# Altium schematic sheet 3V3 Buck Converter.SchDoc: LM27403 3.3V Buck Converter
size Letter; SheetNumber: 4; SheetTotal: 18
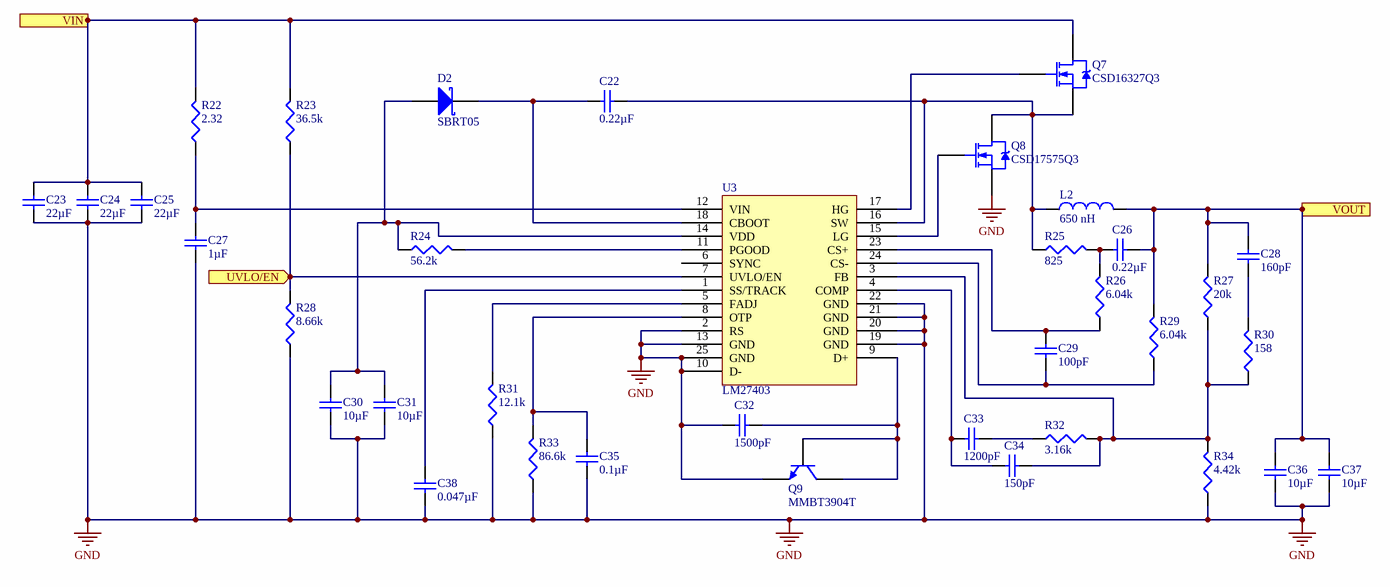
[diagram p0: 3V3 Buck Converter.SchDoc]

## Parts
C22  value 0.22µF  [TY-0402V]  (hidden comment: Cap)
C23  value 22µF  [TY-1210M]  (hidden comment: Cap)
C24  value 22µF  [TY-1210M]  (hidden comment: Cap)
C25  value 22µF  [TY-1210M]  (hidden comment: Cap)
C26  value 0.22µF  [TY-0402V]  (hidden comment: Cap)
C27  value 1µF  [TY-0402V]  (hidden comment: Cap)
C28  value 160pF  [KEM-CBR04]  (hidden comment: Cap)
C29  value 100pF  [TDK-CGA2B]  (hidden comment: Cap)
C30  value 10µF  [TY-0603A]  (hidden comment: Cap)
C31  value 10µF  [TY-0603A]  (hidden comment: Cap)
C32  value 1500pF  [TDK-CGA2B]  (hidden comment: Cap)
C33  value 1200pF  [KEM-0402BB]  (hidden comment: Cap)
C34  value 150pF  [TDK-CGA2B]  (hidden comment: Cap)
C35  value 0.1µF  [TDK-CGA2B]  (hidden comment: Cap)
C36  value 10µF  [TY-1210M]  (hidden comment: Cap)
C37  value 10µF  [TY-1210M]  (hidden comment: Cap)
C38  value 0.047µF  [TDK-CGA2B]  (hidden comment: Cap)
D2  SBRT05  [DIOD-X2-DFN1006-2]
L2  value 650 nH  [CCI-XAL7070]  (hidden comment: XAL7070-651MEC)
Q7  CSD16327Q3  [TI-Q3]
Q8  CSD17575Q3  [TI-Q3]
Q9  MMBT3904T  [SOT523]
R22  value 2.32  [VSH-0402MCS]  (hidden comment: Res3)
R23  value 36.5k  [PANA-ERA2A]  (hidden comment: Res3)
R24  value 56.2k  [PANA-ERA2A]  (hidden comment: Res3)
R25  value 825  [PANA-ERA2A]  (hidden comment: Res3)
R26  value 6.04k  [PANA-ERA2A]  (hidden comment: Res3)
R27  value 20k  [PANA-ERJ2R]  (hidden comment: Res3)
R28  value 8.66k  [PANA-ERA2A]  (hidden comment: Res3)
R29  value 6.04k  [PANA-ERA2A]  (hidden comment: Res3)
R30  value 158  [PANA-ERA2A]  (hidden comment: Res3)
R31  value 12.1k  [PANA-ERA2A]  (hidden comment: Res3)
R32  value 3.16k  [PANA-ERA2A]  (hidden comment: Res3)
R33  value 86.6k  [PANA-ERA2A]  (hidden comment: Res3)
R34  value 4.42k  [PANA-ERA2A]  (hidden comment: Res3)
U3  LM27403  [TI-RTW0024A]

## Ports
UVLO/EN (in), VIN (in), VOUT (out)

## Nets
GND: C23.1 C24.1 C25.1 C27.1 C30.1 C31.1 C32.1 C35.1 C36.1 C37.1 C38.1 Q8.3(S) Q9.1(E) R28.1 R31.1 R33.1 R34.1 U3.2(RS) U3.10(D-) U3.13(GND) U3.19(GND) U3.20(GND) U3.21(GND) U3.22(GND) U3.25(GND)
UVLO/EN: R23.1 R28.2 U3.7(UVLO/EN) ; port UVLO/EN
VIN: C23.2 C24.2 C25.2 Q7.2(D) R22.2 R23.2 ; port VIN
VOUT: C26.2 C28.2 C36.2 C37.2 L2.2 R27.2 R29.2 ; port VOUT
NetC22_1: C22.1 D2.2(K) U3.18(CBOOT)
NetC22_2: C22.2 L2.1 Q7.3(S) Q8.2(D) R25.1 U3.16(SW)
NetC26_1: C26.1 R25.2 R26.2
NetC27_2: C27.2 R22.1 U3.12(VIN)
NetC28_1: C28.1 R30.2
NetC29_1: C29.1 R29.1 U3.24(CS-)
NetC29_2: C29.2 R26.1 U3.23(CS+)
NetC30_2: C30.2 C31.2 D2.1(A) R24.1 U3.14(VDD)
NetC32_2: C32.2 Q9.2(B) Q9.3(C) U3.9(D+)
NetC33_1: C33.1 C34.1 U3.4(COMP)
NetC33_2: C33.2 R32.1
NetC34_2: C34.2 R27.1 R30.1 R32.2 R34.2 U3.3(FB)
NetC35_2: C35.2 R33.2 U3.8(OTP)
NetC38_2: C38.2 U3.1(SS/TRACK)
NetQ7_1: Q7.1(G) U3.17(HG)
NetQ8_1: Q8.1(G) U3.15(LG)
NetR24_2: R24.2 U3.11(PGOOD)
NetR31_2: R31.2 U3.5(FADJ)

Not connected (* = marked no-connect by the designer): U3 6(SYNC)

## Notes on the sheet
- (the "License"); you may not use or redistribute this file except in compliance with the License. You
- This file and the information within it are licensed under the terms of the Apache License, Version 2.0
- Copyright
- Unless required by applicable law or agreed to in writing, content distributed under the License is
- distributed on an "AS IS" BASIS, WITHOUT WARRANTIES OR CONDITIONS OF ANY KIND,
- either express or implied. See the License for the specific language governing permissions and
- limitations under the License.
- may obtain a copy of the License at:
- http://www.apache.org/licenses/LICENSE-2.0
- Title
- Size:
- Date:
- Letter
- Number:
- Time:
- Revision:
- Sheet
- of
- University of Alberta
- Deptartment of Electrical
- and Computer Engineering
- Edmonton AB, Canada
- T6G 1H9
- File:

## Library data of the parts
C22 C26 = PC-TY-00301: CAP CER 0.22UF 50V X5R 0402; Manufacturer Part Number: UMK105BJ224KV-F; Index: 301; Designator: C?; Tolerance: ±10%; Published: 2016-03-13; LatestRevisionDate: 2016-03-13; LatestRevisionNote: ...; PackageReference: 0402 (1005 Metric); Publisher: AlbertaSat; PackageDescription: Chip Capacitor, 2-Leads, Body 1.00x0.50mm, IPC Low Density; Part Number: PC-TY-00301; Supplier Part Number 1: 587-3500-1-ND; Supplier 1: Digi-key; Supplier Link: http://www.digikey.ca/product-search/en?keywords=587-3500-1-ND; Voltage-Rated: 50V; Temperature Coefficient: X5R; Application: General Purpose
C23-C25 = PC-TY-00742: CAP CER 22UF 25V X7R 1210; Manufacturer Part Number: TMK325B7226MM-TR; Index: 742; Designator: C?; Tolerance: ±20%; Published: 2016-03-13; LatestRevisionDate: 2016-03-13; LatestRevisionNote: ...; PackageReference: 1210 (3225 Metric); Publisher: AlbertaSat; PackageDescription: Chip Capacitor, 2-Leads, Body 3.20x2.50mm, IPC Low Density; Part Number: PC-TY-00742; Supplier Part Number 1: 587-2784-1-ND; Supplier 1: Digi-key; Supplier Link: http://www.digikey.ca/product-search/en?keywords=587-2784-1-ND; Voltage-Rated: 25V; Temperature Coefficient: X7R; Application: General Purpose
C27 = PC-TY-00381: CAP CER 1UF 25V X5R 0402; Manufacturer Part Number: TMK105BJ105MV-F; Index: 381; Designator: C?; Tolerance: ±20%; Published: 2016-03-13; LatestRevisionDate: 2016-03-13; LatestRevisionNote: ...; PackageReference: 0402 (1005 Metric); Publisher: AlbertaSat; PackageDescription: Chip Capacitor, 2-Leads, Body 1.00x0.50mm, IPC Low Density; Part Number: PC-TY-00381; Supplier Part Number 1: 587-3245-1-ND; Supplier 1: Digi-key; Supplier Link: http://www.digikey.ca/product-search/en?keywords=587-3245-1-ND; Voltage-Rated: 25V; Temperature Coefficient: X5R; Application: General Purpose
C28 = PC-KEM-03162: CAP CER 160PF 50V C0G/NP0 0402; Manufacturer Part Number: C0402C161J5GAC7867; Index: 3162; Designator: C?; Tolerance: ±5%; Temperature Coefficient: C0G, NP0; Published: 2019-08-09; LatestRevisionDate: 2019-08-09; LatestRevisionNote: ...; PackageReference: 0402 (1005 Metric); Publisher: AlbertaSat; PackageDescription: Chip Capacitor, 2-Leads, Body 1.00x0.50mm, IPC Low Density; Part Number: PC-KEM-03162; Supplier Part Number 1: 399-14888-1-ND; Supplier 1: Digi-key; Supplier Part Number 2: 80-C0402C161J5G; Supplier 2: Mouser; Supplier Link: #https://www.digikey.ca/products/en?keywords=399-14888-1-ND#; Voltage - Rated: 50V; Applications: General Purpose
C29 = PC-TDK-01227: CAP CER 100PF 50V C0G 0402; Manufacturer Part Number: CGA2B2C0G1H101J050BA; Index: 1227; Designator: C?; Tolerance: ±5%; Temperature Coefficient: NP0; Published: 2016-03-16; LatestRevisionDate: 2016-03-16; LatestRevisionNote: ...; PackageReference: 0402 (1005 Metric); Publisher: AlbertaSat; PackageDescription: Radial Cap, Thru-Hole; 2 Leads; 0.3 in Pin Spacing; Part Number: PC-TDK-01227; Supplier Part Number 1: 445-5596-1-ND; Supplier 1: Digi-key; Supplier Link: http://www.digikey.ca/product-search/en?keywords=445-5596-1-ND; Voltage - Rated: 50V; Applications: Automotive
C30 C31 = PC-TY-00593: CAP CER 10UF 16V X5R 0603; Manufacturer Part Number: EMK107BBJ106MA-T; Index: 593; Designator: C?; Tolerance: ±20%; Published: 2016-03-13; LatestRevisionDate: 2016-03-13; LatestRevisionNote: ...; PackageReference: 0603 (1608 Metric); Publisher: AlbertaSat; PackageDescription: Chip Capacitor, 2-Leads, Body 1.60x0.80mm, IPC Low Density; Part Number: PC-TY-00593; Supplier Part Number 1: 587-3238-1-ND; Supplier 1: Digi-key; Supplier Link: http://www.digikey.ca/product-search/en?keywords=587-3238-1-ND; Voltage-Rated: 16V; Temperature Coefficient: X5R; Application: General Purpose
C32 = PC-TDK-01528: CAP CER 1500PF 50V X8R 0402; Manufacturer Part Number: CGA2B2X8R1H152K050BA; Index: 1528; Designator: C?; Tolerance: ±10%; Published: 2016-03-16; LatestRevisionDate: 2016-03-16; LatestRevisionNote: ...; PackageReference: 0402 (1005 Metric); Publisher: AlbertaSat; PackageDescription: Radial Cap, Thru-Hole; 2 Leads; 0.3 in Pin Spacing; Part Number: PC-TDK-01528; Supplier Part Number 1: 445-5880-1-ND; Supplier 1: Digi-key; Supplier Link: http://www.digikey.ca/product-search/en?keywords=445-5880-1-ND; Voltage - Rated: 50V; Temperature Coefficient: X8R; Applications: Automotive
C33 = PC-KEM-01136: CAP CER 1200PF 50V NP0 0402; Manufacturer Part Number: C0402C122J5GACTU; Index: 1136; Designator: C?; Tolerance: ±5%; Published: 2016-03-13; LatestRevisionDate: 2016-03-13; LatestRevisionNote: ...; PackageReference: 0402 (1005 Metric); Publisher: AlbertaSat; PackageDescription: Chip Capacitor, 2-Leads, Body 1.00x0.50mm, IPC Low Density; Part Number: PC-KEM-01136; Supplier Part Number 1: 399-7334-1-ND; Supplier 1: Digi-key; Supplier Link: http://www.digikey.ca/product-search/en?keywords=399-7334-1-ND; Voltage - Rated: 50V; Temperature Coefficient: NP0; Applications: General Purpose
C34 = PC-TDK-01264: CAP CER 150PF 50V C0G 0402; Manufacturer Part Number: CGA2B2C0G1H151J050BA; Index: 1264; Designator: C?; Tolerance: ±5%; Temperature Coefficient: NP0; Published: 2016-03-16; LatestRevisionDate: 2016-03-16; LatestRevisionNote: ...; PackageReference: 0402 (1005 Metric); Publisher: AlbertaSat; PackageDescription: Radial Cap, Thru-Hole; 2 Leads; 0.3 in Pin Spacing; Part Number: PC-TDK-01264; Supplier Part Number 1: 445-5598-1-ND; Supplier 1: Digi-key; Supplier Link: http://www.digikey.ca/product-search/en?keywords=445-5598-1-ND; Voltage - Rated: 50V; Applications: Automotive
C35 = PC-TDK-02246: CAP CER 0.1UF 10V X5R 0402; Manufacturer Part Number: CGA2B2X5R1A104K050BA; Index: 2246; Designator: C?; Tolerance: ±10%; Published: 2016-03-16; LatestRevisionDate: 2016-03-16; LatestRevisionNote: ...; PackageReference: 0402 (1005 Metric); Publisher: AlbertaSat; PackageDescription: Radial Cap, Thru-Hole; 2 Leads; 0.3 in Pin Spacing; Part Number: PC-TDK-02246; Supplier Part Number 1: 445-12156-1-ND; Supplier 1: Digi-key; Supplier Link: http://www.digikey.ca/product-search/en?keywords=445-12156-1-ND; Voltage - Rated: 10V; Temperature Coefficient: X5R; Applications: Automotive
C36 C37 = PC-TY-00679: CAP CER 10UF 50V X7R 1210; Manufacturer Part Number: UMK325AB7106KM-T; Index: 679; Designator: C?; Tolerance: ±10%; Published: 2016-03-13; LatestRevisionDate: 2016-03-13; LatestRevisionNote: ...; PackageReference: 1210 (3225 Metric); Publisher: AlbertaSat; PackageDescription: Chip Capacitor, 2-Leads, Body 3.20x2.50mm, IPC Low Density; Part Number: PC-TY-00679; Supplier Part Number 1: 587-3167-1-ND; Supplier 1: Digi-key; Supplier Link: http://www.digikey.ca/product-search/en?keywords=587-3167-1-ND; Voltage-Rated: 50V; Temperature Coefficient: X7R; Application: General Purpose
C38 = PC-TDK-02123: CAP CER 0.047UF 25V X7R 0402; Manufacturer Part Number: CGA2B1X7R1E473K050BC; Index: 2123; Designator: C?; Tolerance: ±10%; Published: 2016-03-16; LatestRevisionDate: 2016-03-16; LatestRevisionNote: ...; PackageReference: 0402 (1005 Metric); Publisher: AlbertaSat; PackageDescription: Radial Cap, Thru-Hole; 2 Leads; 0.3 in Pin Spacing; Part Number: PC-TDK-02123; Supplier Part Number 1: 445-5610-1-ND; Supplier 1: Digi-key; Supplier Link: http://www.digikey.ca/product-search/en?keywords=445-5610-1-ND; Voltage - Rated: 25V; Temperature Coefficient: X7R; Applications: Automotive
D2 = 29: SUPER BARRIER RECTIFIER X2-DFN10; Part Number: 29; Manufacturer Part Number: SBRT05U20LPS-7B; Designator: D?; Voltage - Forward (Max): 390mV @ 500mA; Published: 8-Jun-2000; LatestRevisionDate: 17-Jul-2002; LatestRevisionNote: Re-released for DXP Platform.; PackageReference: DFN 0402 (1006 Metric); Publisher: Altium Limited; PackageDescription: DO-214-AA/SMB; 2 C-Bend Leads; Body 5.3 x 3.6 mm, inc. leads (LxW); Code_JEDEC: DO-214-AA; Supplier Part Number 1: SBRT05U20LPS-7BDICT-ND; Supplier 1: Digi-Key; Supplier Part Number 2: 621-SBRT05U20LPS-7B; Supplier 2: Mouser; Supplier Link: #https://www.digikey.ca/products/en?keywords=SBRT05U20LPS-7BDICT-ND#
L2 = PL-CCI-00013: Fixed Inductors 0.65uH 20% 26.5A 1.93mOhms AEC-Q200; Code_IEC: 1005; Index: 13; Designator: L?; Published: 2019-08-06; LatestRevisionDate: 2019-08-06; LatestRevisionNote: ...; PackageReference: CCI-XAL7070; Publisher: AlbertaSat; PackageDescription: Precision Wire Wound Inductor, 2-Leads, Body 7.20x7.50mm, IPC Low Density; Code_JEITA: 0402; Part Number: PL-CCI-00013; Manufacturer Part Number: XAL7070-651MEC; Supplier Part Number 1: 994-XAL7070-651MEC; Supplier 1: Mouser; Supplier Part Number 2: XAL7070-651MEC; Supplier 2: Coilcraft Direct; Supplier Link: #https://www.mouser.ca/ProductDetail/Coilcraft/XAL7070-651MEC?qs=%2Fha2pyFaduhG5%252Ba4CuVa5jFvImje735VGlWzHt6zjMOzK5HnICZz8T3bLeKmdOa2#
Q7 = 62: MOSFET N-CH 25V 60A 8SON; Part Number: 62; Note: Pin 2 is electrically connected to pin 4.; Designator: Q?; Published: 8-Jun-2000; LatestRevisionDate: 17-Jul-2002; LatestRevisionNote: Re-released for DXP Platform.; DatasheetVersion: PD-9.814; PackageVersion: Feb-1997; PackageReference: 8-VSON-CLIP (3.3x3.3); Publisher: Altium Limited; PackageDescription: TO, Thru-Hole, Vertical, Heatsink Mounted; 3 In-Line Leads; Pitch 2.54 mm; ComponentLink1Description: Manufacturer Link; ComponentLink1URL: http://www.irf.com/; Supplier Part Number 2: 595-CSD16327Q3; Supplier 2: Mouser; Manufacturer Part Number: CSD16327Q3; Supplier Part Number 1: 296-30138-1-ND; Supplier 1: Digi-Key; Supplier Link: #https://www.digikey.ca/product-detail/en/texas-instruments/CSD16327Q3/296-30138-1-ND/2811417#; Operating Temperature: -55°C ~ 150°C (TJ)
Q8 = 63: N-Channel 30V 60A (Ta) 2.8W (Ta), 108W (Tc) Surface Mount 8-VSON-CLIP (3.3x3.3); Part Number: 63; Note: Pin 2 is electrically connected to pin 4.; Designator: Q?; Published: 8-Jun-2000; LatestRevisionDate: 17-Jul-2002; LatestRevisionNote: Re-released for DXP Platform.; DatasheetVersion: PD-9.814; PackageVersion: Feb-1997; PackageReference: 8-VSON-CLIP (3.3x3.3); Publisher: Altium Limited; PackageDescription: TO, Thru-Hole, Vertical, Heatsink Mounted; 3 In-Line Leads; Pitch 2.54 mm; ComponentLink1Description: Manufacturer Link; ComponentLink1URL: http://www.irf.com/; Supplier Part Number 2: 595-CSD17575Q3; Supplier 2: Mouser; Manufacturer Part Number: CSD17575Q3; Supplier Part Number 1: 296-39994-1-ND; Supplier 1: Digi-Key; Supplier Link: #https://www.digikey.ca/product-detail/en/texas-instruments/CSD17575Q3/296-39994-1-ND/5177871#; Operating Temperature: -55°C ~ 150°C (TJ)
Q9 = 34: Bipolar (BJT) Transistor NPN 40V 200mA 300MHz 150mW Surface Mount SOT-523; Part Number: 34; Manufacturer Part Number: MMBT3904T-7-F; Designator: Q?; Published: 8-Jun-2000; LatestRevisionDate: 15-Jan-2003; LatestRevisionNote: PCB Footprint 'BCY-W3/D4.7' replaced; DatasheetVersion: 1997; PackageVersion: Sep-1998; PackageReference: SOT523; Publisher: Altium Limited; PackageDescription: TO, Flat Index; 3 In-Line, Axial Leads; Body Dia. 4.5mm; Leads 0.51 x 0.48 mm (max); ComponentLink1Description: Manufacturer Link; ComponentLink1URL: http://www.fairchildsemi.com/; ComponentLink2Description: Datasheet; ComponentLink2URL: http://www.fairchildsemi.com/ds/2N%2F2N3904.pdf; Supplier Part Number 1: MMBT3904T-FDICT-ND; Supplier 1: Digi-Key; Supplier Link: #https://www.digikey.ca/product-detail/en/diodes-incorporated/MMBT3904T-7-F/MMBT3904T-FDICT-ND/725060#
R22 = PR-VSH-00271: RES SMD 2.32 OHM 1% 1/16W 0402; Manufacturer Part Number: CRCW04022R32FKED; Index: 271; Designator: R?; Temperature Coefficient: ±100ppm/°C; Published: 2019-05-31; LatestRevisionDate: 2019-05-31; LatestRevisionNote: ...; PackageReference: 0402 (1005 Metric); Publisher: AlbertaSat; PackageDescription: Chip Resistor, 2-Leads, Body 1.00x0.50mm, IPC Low Density; Part Number: PR-VSH-00271; Supplier Part Number 1: 541-2.32LLCT-ND; Supplier 1: Digi-key; Supplier Part Number 2: 71-CRCW04022R32FKED; Supplier 2: Mouser; Supplier Link: #https://www.digikey.ca/products/en/resistors/chip-resistor-surface-mount/52?k=CRCW04022R32FKED&k=&pkeyword=CRCW04022R32FKED&sv=0&pv7=2&sf=0&quantity=&ColumnSort=0&page=1&stock=1&pageSize=25#; Tolerance: ±1%; Power - Rated: 1/16W; Applications: Automotive
R23 = 18127: RES SMD 36.5KOHM 0.1% 1/16W 0402; Part Number: 18127; Manufacturer Part Number: ERA-2AEB3652X; Designator: R?; Power: 0.063W, 1/16W; Temperature Coefficient: ±25ppm/°C; Published: 8-Jun-2000; LatestRevisionDate: 29-May-2009; LatestRevisionNote: IPC-7351 Footprint Added.; PackageReference: 0402 (1005 Metric); Publisher: Altium Limited; PackageDescription: Chip Resistor, 2-Leads, Body 1.00x0.50mm, IPC Low Density; Supplier Part Number 1: P36.5KDCCT-ND; Supplier 1: Digi-Key; Supplier Link: http://www.digikey.ca/product-search/en?keywords=P36.5KDCCT-ND; Tolerance: ±0.1%
R24 = 18410: RES SMD 56.2KOHM 0.1% 1/16W 0402; Part Number: 18410; Manufacturer Part Number: ERA-2AEB5622X; Designator: R?; Power: 0.063W, 1/16W; Temperature Coefficient: ±25ppm/°C; Published: 8-Jun-2000; LatestRevisionDate: 29-May-2009; LatestRevisionNote: IPC-7351 Footprint Added.; PackageReference: 0402 (1005 Metric); Publisher: Altium Limited; PackageDescription: Chip Resistor, 2-Leads, Body 1.00x0.50mm, IPC Low Density; Supplier Part Number 1: P56.2KDCCT-ND; Supplier 1: Digi-Key; Supplier Link: http://www.digikey.ca/product-search/en?keywords=P56.2KDCCT-ND; Tolerance: ±0.1%
R25 = 15284: RES SMD 825 OHM 0.1% 1/16W 0402; Part Number: 15284; Manufacturer Part Number: ERA-2AEB8250X; Designator: R?; Power: 0.063W, 1/16W; Temperature Coefficient: ±25ppm/°C; Published: 8-Jun-2000; LatestRevisionDate: 29-May-2009; LatestRevisionNote: IPC-7351 Footprint Added.; PackageReference: 0402 (1005 Metric); Publisher: Altium Limited; PackageDescription: Chip Resistor, 2-Leads, Body 1.00x0.50mm, IPC Low Density; Supplier Part Number 1: P825DCCT-ND; Supplier 1: Digi-Key; Supplier Link: http://www.digikey.ca/product-search/en?keywords=P825DCCT-ND; Tolerance: ±0.1%
R26 R29 = 16832: RES SMD 6.04KOHM 0.1% 1/16W 0402; Part Number: 16832; Manufacturer Part Number: ERA-2AEB6041X; Designator: R?; Power: 0.063W, 1/16W; Temperature Coefficient: ±25ppm/°C; Published: 8-Jun-2000; LatestRevisionDate: 29-May-2009; LatestRevisionNote: IPC-7351 Footprint Added.; PackageReference: 0402 (1005 Metric); Publisher: Altium Limited; PackageDescription: Chip Resistor, 2-Leads, Body 1.00x0.50mm, IPC Low Density; Supplier Part Number 1: P6.04KDCCT-ND; Supplier 1: Digi-Key; Supplier Link: http://www.digikey.ca/product-search/en?keywords=P6.04KDCCT-ND; Tolerance: ±0.1%
R27 = 17706: RES SMD 20K OHM 1% 1/10W 0402; Part Number: 17706; Manufacturer Part Number: ERJ-2RKF2002X; Designator: R?; Power: 0.1W, 1/10W; Temperature Coefficient: ±100ppm/°C; Published: 8-Jun-2000; LatestRevisionDate: 29-May-2009; LatestRevisionNote: IPC-7351 Footprint Added.; PackageReference: 0402 (1005 Metric); Publisher: Altium Limited; PackageDescription: Chip Resistor, 2-Leads, Body 1.00x0.50mm, IPC Low Density; Supplier Part Number 1: P20.0KLCT-ND; Supplier 1: Digi-Key; Supplier Link: http://www.digikey.ca/product-search/en?keywords=P20.0KLCT-ND; Tolerance: ±1%
R28 = 17100: RES SMD 8.66KOHM 0.1% 1/16W 0402; Part Number: 17100; Manufacturer Part Number: ERA-2AEB8661X; Designator: R?; Power: 0.063W, 1/16W; Temperature Coefficient: ±25ppm/°C; Published: 8-Jun-2000; LatestRevisionDate: 29-May-2009; LatestRevisionNote: IPC-7351 Footprint Added.; PackageReference: 0402 (1005 Metric); Publisher: Altium Limited; PackageDescription: Chip Resistor, 2-Leads, Body 1.00x0.50mm, IPC Low Density; Supplier Part Number 1: P8.66KDCCT-ND; Supplier 1: Digi-Key; Supplier Link: http://www.digikey.ca/product-search/en?keywords=P8.66KDCCT-ND; Tolerance: ±0.1%
R30 = 14285: RES SMD 158 OHM 0.1% 1/16W 0402; Part Number: 14285; Manufacturer Part Number: ERA-2AEB1580X; Designator: R?; Power: 0.063W, 1/16W; Temperature Coefficient: ±25ppm/°C; Published: 8-Jun-2000; LatestRevisionDate: 29-May-2009; LatestRevisionNote: IPC-7351 Footprint Added.; PackageReference: 0402 (1005 Metric); Publisher: Altium Limited; PackageDescription: Chip Resistor, 2-Leads, Body 1.00x0.50mm, IPC Low Density; Supplier Part Number 1: P158DCCT-ND; Supplier 1: Digi-Key; Supplier Link: http://www.digikey.ca/product-search/en?keywords=P158DCCT-ND; Tolerance: ±0.1%
R31 = 17334: RES SMD 12.1KOHM 0.1% 1/16W 0402; Part Number: 17334; Manufacturer Part Number: ERA-2AEB1212X; Designator: R?; Power: 0.063W, 1/16W; Temperature Coefficient: ±25ppm/°C; Published: 8-Jun-2000; LatestRevisionDate: 29-May-2009; LatestRevisionNote: IPC-7351 Footprint Added.; PackageReference: 0402 (1005 Metric); Publisher: Altium Limited; PackageDescription: Chip Resistor, 2-Leads, Body 1.00x0.50mm, IPC Low Density; Supplier Part Number 1: P12.1KDCCT-ND; Supplier 1: Digi-Key; Supplier Link: http://www.digikey.ca/product-search/en?keywords=P12.1KDCCT-ND; Tolerance: ±0.1%
R32 = 16332: RES SMD 3.16KOHM 0.1% 1/16W 0402; Part Number: 16332; Manufacturer Part Number: ERA-2AEB3161X; Designator: R?; Power: 0.063W, 1/16W; Temperature Coefficient: ±25ppm/°C; Published: 8-Jun-2000; LatestRevisionDate: 29-May-2009; LatestRevisionNote: IPC-7351 Footprint Added.; PackageReference: 0402 (1005 Metric); Publisher: Altium Limited; PackageDescription: Chip Resistor, 2-Leads, Body 1.00x0.50mm, IPC Low Density; Supplier Part Number 1: P3.16KDCCT-ND; Supplier 1: Digi-Key; Supplier Link: http://www.digikey.ca/product-search/en?keywords=P3.16KDCCT-ND; Tolerance: ±0.1%
R33 = 18660: RES SMD 86.6KOHM 0.1% 1/16W 0402; Part Number: 18660; Manufacturer Part Number: ERA-2AEB8662X; Designator: R?; Power: 0.063W, 1/16W; Temperature Coefficient: ±25ppm/°C; Published: 8-Jun-2000; LatestRevisionDate: 29-May-2009; LatestRevisionNote: IPC-7351 Footprint Added.; PackageReference: 0402 (1005 Metric); Publisher: Altium Limited; PackageDescription: Chip Resistor, 2-Leads, Body 1.00x0.50mm, IPC Low Density; Supplier Part Number 1: P86.6KDCCT-ND; Supplier 1: Digi-Key; Supplier Link: http://www.digikey.ca/product-search/en?keywords=P86.6KDCCT-ND; Tolerance: ±0.1%
R34 = 16610: RES SMD 4.42KOHM 0.1% 1/16W 0402; Part Number: 16610; Manufacturer Part Number: ERA-2AEB4421X; Designator: R?; Power: 0.063W, 1/16W; Temperature Coefficient: ±25ppm/°C; Published: 8-Jun-2000; LatestRevisionDate: 29-May-2009; LatestRevisionNote: IPC-7351 Footprint Added.; PackageReference: 0402 (1005 Metric); Publisher: Altium Limited; PackageDescription: Chip Resistor, 2-Leads, Body 1.00x0.50mm, IPC Low Density; Supplier Part Number 1: P4.42KDCCT-ND; Supplier 1: Digi-Key; Supplier Link: http://www.digikey.ca/product-search/en?keywords=P4.42KDCCT-ND; Tolerance: ±0.1%
U3 = 61: Buck Regulator Positive Output Step-Down  DC-DC Controller IC 24-WQFN (4x4); Part Number: 61; Supplier Part Number 2: 595-LM27403SQ/NOPB; Supplier 2: Mouser; Manufacturer Part Number: LM27403SQ/NOPB; Supplier Part Number 1: 296-37015-1-ND; Supplier 1: Digi-Key; Supplier Link: https://www.digikey.ca/product-detail/en/texas-instruments/LM27403SQ-NOPB/296-37015-1-ND/4430488; PackageReference: 24-WFQFN Exposed Pad; Operating Temperature: -40°C ~ 125°C (TJ)